# Altium project JailDoor_V01.PrjPCB
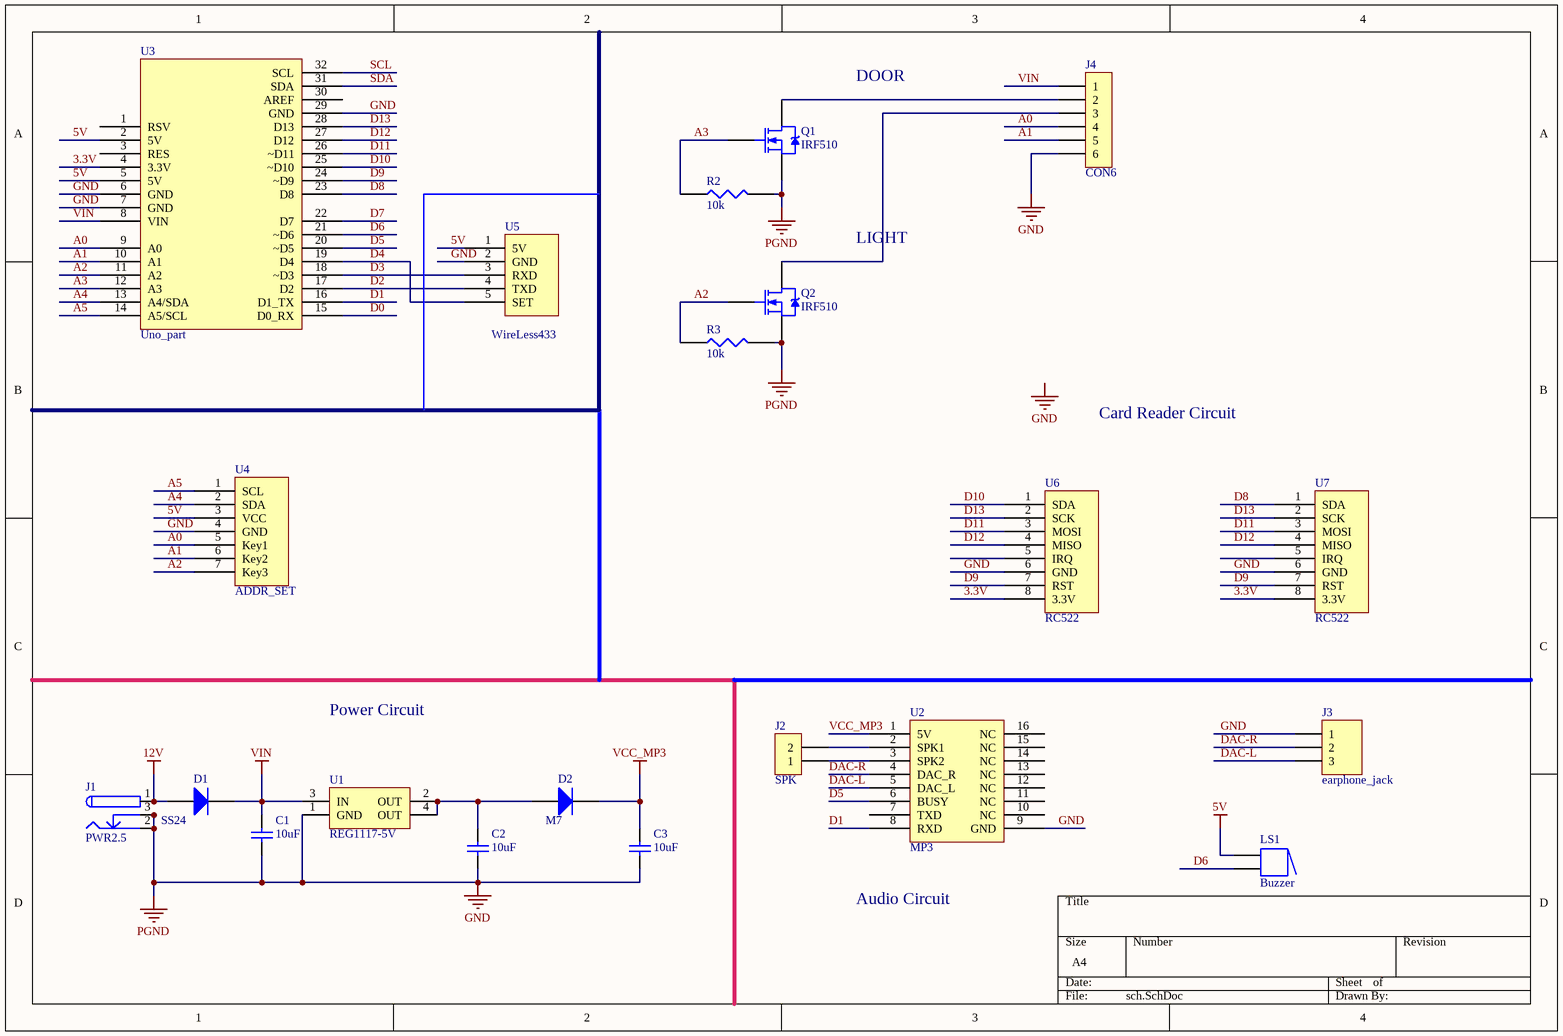
[diagram p0: sch.SchDoc]
1 sheet, 21 parts. Net scope: global (net labels, ports and power ports of the same name join across sheets).
Board file: pcb.PcbDoc

## Sheet sch.SchDoc
size A4

### Parts
C1  value 10uF  [1206]  (hidden comment: Cap Semi)
C2  value 10uF  [1206]  (hidden comment: Cap Semi)
C3  value 10uF  [1206]  (hidden comment: Cap Semi)
D1  SS24  [SMB]
D2  M7  [SMA]
J1  PWR2.5  [KLD-0202_new]
J2  SPK  [DG1282]
J3  earphone_jack  [Phone-Jack]
J4  CON6  [POWER CONN6]
LS1  Buzzer  [BUZZ]
Q1  IRF510  [TO-220]
Q2  IRF510  [TO-220]
R2  10k  [1206]
R3  10k  [1206]
U1  REG1117-5V  [SOT223]
U2  MP3  [MP3]
U3  Uno_part  [UNO]
U4  ADDR_SET  [HDR1X7]
U5  WireLess433  [HDR1X5]
U6  RC522  [HDR1X8]
U7  RC522  [HDR1X8]

### Nets
5V: LS1.1 U3.2(5V) U3.5(5V) U4.3(VCC) U5.1(5V)
12V: D1.A J1.1 J1.1A J1.1B
GND: C1.1 C2.1 C3.1 J1.2 J1.2A J1.2B J1.3 J1.3A J1.3B J3.1 J4.6 Q1.3(S) Q2.3(S) R2.2 R3.2 U1.1(GND) U2.9(GND) U3.6(GND) U3.7(GND) U3.29(GND) U4.4(GND) U5.2(GND) U6.6(GND) U7.6(GND)  [also labelled PGND]
VCC_MP3: C3.2 D2.K U2.1(5V)
VIN: C1.2 D1.K J4.1 U1.3(IN) U3.8(VIN)
3.3V: U3.4(3.3V) U6.8(3.3V) U7.8(3.3V)
A0: J4.4 U3.9(A0) U4.5(Key1)
A1: J4.5 U3.10(A1) U4.6(Key2)
A2: Q2.1(G) R3.1 U3.11(A2) U4.7(Key3)
A3: Q1.1(G) R2.1 U3.12(A3)
A4: U3.13(A4/SDA) U4.2(SDA)
A5: U3.14(A5/SCL) U4.1(SCL)
D0: U3.15(D0_RX)
D1: U2.8(RXD) U3.16(D1_TX)
D2: U3.17(D2) U5.4(TXD)
D3: U3.18(~D3) U5.3(RXD)
D4: U3.19(D4) U5.5(SET)
D5: U2.6(BUSY) U3.20(~D5)
D6: LS1.2 U3.21(~D6)
D7: U3.22(D7)
D8: U3.23(D8) U7.1(SDA)
D9: U3.24(~D9) U6.7(RST) U7.7(RST)
D10: U3.25(~D10) U6.1(SDA)
D11: U3.26(~D11) U6.3(MOSI) U7.3(MOSI)
D12: U3.27(D12) U6.4(MISO) U7.4(MISO)
D13: U3.28(D13) U6.2(SCK) U7.2(SCK)
DAC-L: J3.3 U2.5(DAC_L)
DAC-R: J3.2 U2.4(DAC_R)
SCL: U3.32(SCL)
SDA: U3.31(SDA)
NetC2_2: C2.2 D2.A U1.2(OUT) U1.4(OUT)
NetJ2_1: J2.1 U2.3(SPK2)
NetJ2_2: J2.2 U2.2(SPK1)
NetJ4_2: J4.2 Q1.2(D)
NetJ4_3: J4.3 Q2.2(D)

Not connected (* = marked no-connect by the designer): U2 7(TXD) 10(NC) 11(NC) 12(NC) 13(NC) 14(NC) 15(NC) 16(NC); U3 1(RSV) 3(RES) 30(AREF); U6 5(IRQ); U7 5(IRQ)

### Notes on the sheet
- DOOR
- LIGHT
- Card Reader Circuit
- Power Circuit
- Audio Circuit
- Labels drawn without touching a wire or pin: GND

### Library data of the parts
C1-C3 = Cap Semi: Capacitor (Semiconductor SIM Model); Published: 8-Jun-2000; LatestRevisionDate: 17-Jul-2002; LatestRevisionNote: Re-released for DXP Platform.; PackageReference: C1206; Publisher: Altium Limited
D1 D2 = Diode 1N4001: 1 Amp General Purpose Rectifier; Published: 8-Jun-2000; LatestRevisionDate: 17-Jul-2002; LatestRevisionNote: Re-released for DXP Platform.; DatasheetDocument: 1998; PackageDocument: Aug-1999; PackageReference: DO-41; Publisher: Altium Limited; Code_JEDEC: DO-204-AL; Cost: 0.5
J1 = PWR2.5: Low Voltage Power Supply Connector; pin to pad: 1A>1 1B>1 2A>2 2B>2 3A>3 3B>3; Published: 17-Dec-2003; DatasheetDocument: 09-May-2002; Publisher: Altium Limited; ComponentLink1Description: Manufacturer Link; ComponentLink1URL: http://domino.kycon.com/internet/Products.html
J2 = CON2
J3 = Header 3: Header, 3-Pin; LatestRevisionDate: 17-Jul-2002; LatestRevisionNote: Re-released for DXP Platform.; Publisher: Altium Limited
J4 = CON6: Connector
LS1 = Buzzer: Magnetic Transducer Buzzer; pin to pad: 1A>1 2A>2; Published: 24-Mar-1999; LatestRevisionDate: 17-Dec-2003; LatestRevisionNote: Schematic revised, PCB Footprint replaced.; DatasheetVersion: 17-Dec-2003; PackageReference: ABSM-1574; Publisher: Altium Limited; ComponentLink1Description: Manufacturer Link; ComponentLink1URL: http://www.megastar.com/linecard/buzzmode/index.php
Q1 Q2 = IRF510: HEXFET N-Channel Power MOSFET; Note: Pin 2 is electrically connected to pin 4.; Published: 8-Jun-2000; LatestRevisionDate: 17-Jul-2002; LatestRevisionNote: Re-released for DXP Platform.; DatasheetDocument: PD-9.325Q; PackageDocument: Feb-1997; PackageReference: TO-220AB; Publisher: Altium Limited; Cost: 2
R2 R3 = RES1
U1 = REG1117-2.85: 800mA and 1A Low Dropout Positive Regulator 2.85V, 3.3V, 5V, and Adjustable; PackageDocument: revC; Published: 8-Jun-2000; LatestRevisionDate: 17-Jul-2002; LatestRevisionNote: Re-released for DXP Platform.; DatasheetDocument: Sep-1997; PackageReference: ZZ311; Publisher: Altium Limited; Cost: 0.5
U2 = MP3: Cost: 15; Website: https://item.taobao.com/item.htm?spm=2013.1.w1031-6089264916.10.9ekZTM&id=40211929619
U3 = Uno_part: Cost: 20
U5 = WireLess433: Cost: 21; Website: https://detail.tmall.com/item.htm?spm=a230r.1.14.28.p06yUE&id=41647104575&ns=1&abbucket=3
U6 U7 = RC522: Cost: 10; Website: https://detail.tmall.com/item.htm?id=41286608549&ali_refid=a3_430583_1006:1109983619:N:MFRC-522:0efdd27495b7e04bcef49b37e14626a1&ali_trackid=1_0efdd27495b7e04bcef49b37e14626a1&spm=a230r.1.14.1.xpelsc